# Altium schematic sheet Wireless.SchDoc: main_assy PCB
size A4
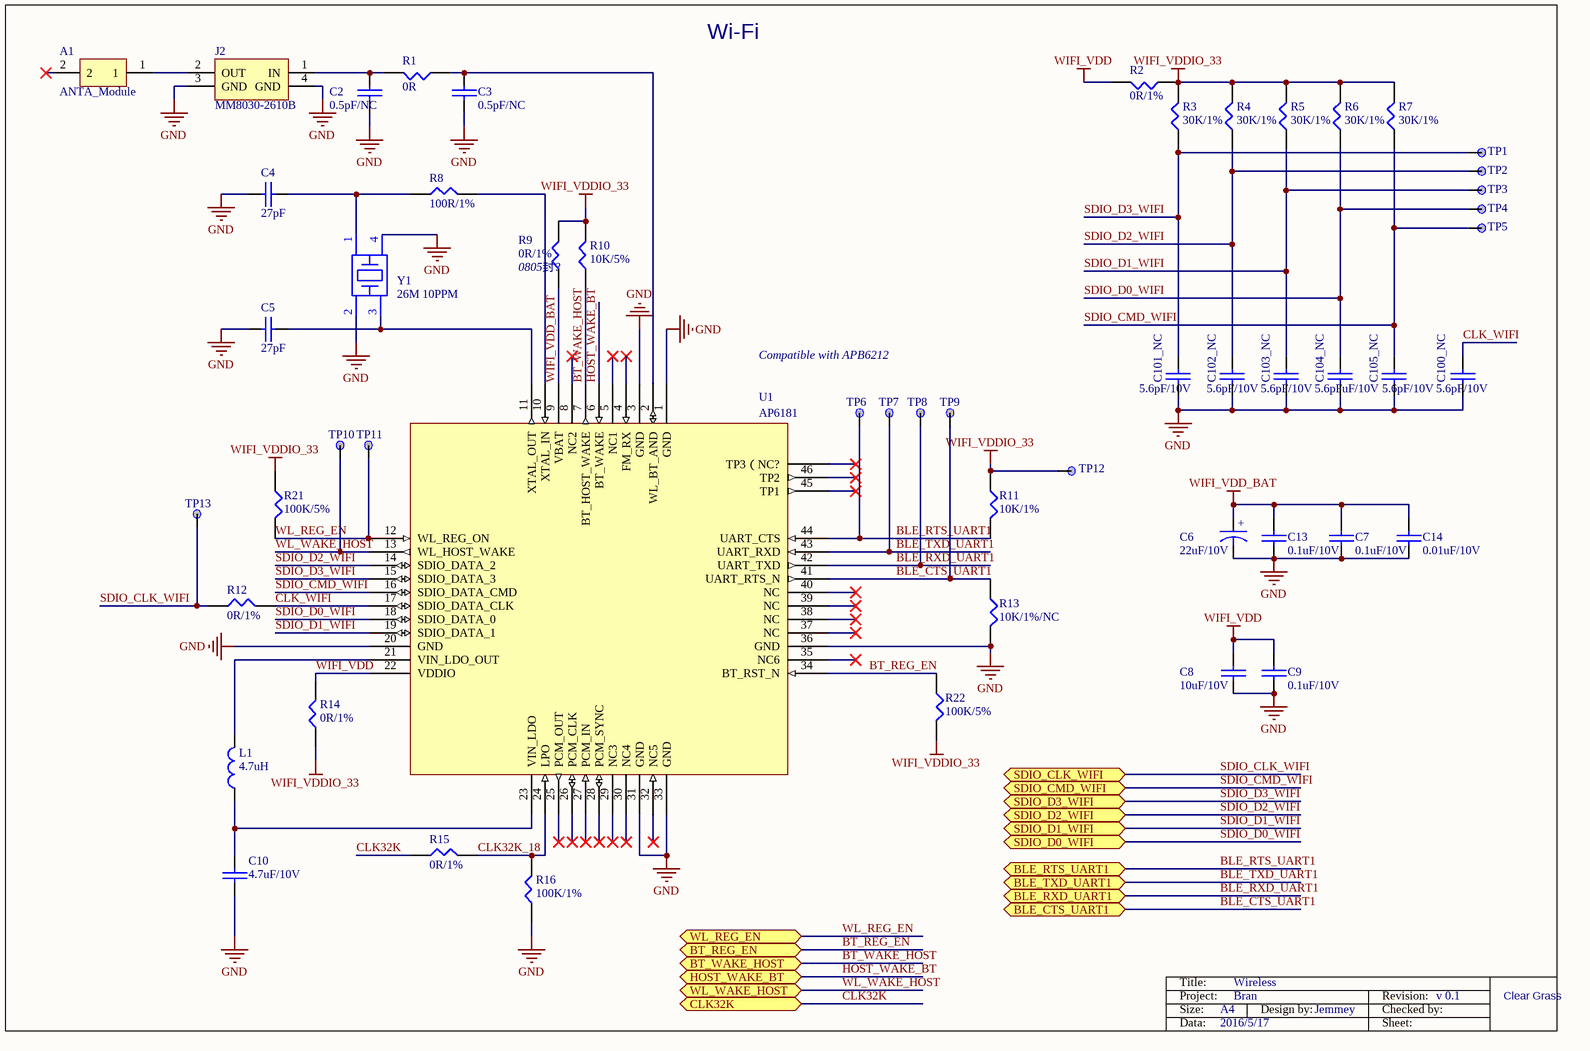
[diagram p0: Wireless.SchDoc]

## Parts
A1  ANTA_Module  [IPEX]
C2  0.5pF/NC  [0402C]
C3  0.5pF/NC  [0402C]
C4  27pF  [0402C]
C5  27pF  [0402C]
C6  22uF/10V  [6032]
C7  0.1uF/10V  [0402C]
C8  10uF/10V  [0402C]
C9  0.1uF/10V  [0402C]
C10  4.7uF/10V  [0402C]
C13  0.1uF/10V  [0402C]
C14  0.01uF/10V  [0402C]
C100_NC  5.6pF/10V  [0402C]
C101_NC  5.6pF/10V  [0402C]
C102_NC  5.6pF/10V  [0402C]
C103_NC  5.6pF/10V  [0402C]
C104_NC  5.6pFuF/10V  [0402C]
C105_NC  5.6pF/10V  [0402C]
J2  MM8030-2610B  [IPEX]
L1  4.7uH  [Inductance]
R1  0R  [0402R]
R2  0R/1%  [0402R]
R3  30K/1%  [0402R]
R4  30K/1%  [0402R]
R5  30K/1%  [0402R]
R6  30K/1%  [0402R]
R7  30K/1%  [0402R]
R8  100R/1%  [0402R]
R9  0R/1%  [0402R]
R10  10K/5%  [0402R]
R11  10K/1%  [0402R]
R12  0R/1%  [0402R]
R13  10K/1%/NC  [0402R]
R14  0R/1%  [0402R]
R15  0R/1%  [0402R]
R16  100K/1%  [0402R]
R21  100K/5%  [0402R]
R22  100K/5%  [0402R]
TP1  TP  [TP_C40]  (value not drawn)
TP2  TP  [TP_C40]  (value not drawn)
TP3  TP  [TP_C40]  (value not drawn)
TP4  TP  [TP_C40]  (value not drawn)
TP5  TP  [TP_C40]  (value not drawn)
TP6  TP  [TP_C40]  (value not drawn)
TP7  TP  [TP_C40]  (value not drawn)
TP8  TP  [TP_C40]  (value not drawn)
TP9  TP  [TP_C40]  (value not drawn)
TP10  TP  [TP_C40]  (value not drawn)
TP11  TP  [TP_C40]  (value not drawn)
TP12  TP  [TP_C40]  (value not drawn)
TP13  TP  [TP_C40]  (value not drawn)
U1  AP6181
Y1  26M 10PPM  [XTALSMD2-2520]

## Ports
BLE_CTS_UART1 (bidir), BLE_RTS_UART1 (bidir), BLE_RXD_UART1 (bidir), BLE_TXD_UART1 (bidir), BT_REG_EN (bidir), BT_WAKE_HOST (bidir), CLK32K (bidir), HOST_WAKE_BT (bidir), SDIO_CLK_WIFI (bidir), SDIO_CMD_WIFI (bidir), SDIO_D0_WIFI (bidir), SDIO_D1_WIFI (bidir), SDIO_D2_WIFI (bidir), SDIO_D3_WIFI (bidir), WL_REG_EN (bidir), WL_WAKE_HOST (bidir)

## Nets
GND: C2.2 C3.2 C4.1 C5.1 C6.2 C7.1 C8.1 C9.1 C10.2 C13.1 C14.1 C100_NC.1 C101_NC.1 C102_NC.1 C103_NC.1 C104_NC.1 C105_NC.1 J2.3(GND) J2.4(GND) R13.2 R16.1 U1.1(GND) U1.3(GND) U1.20(GND) U1.31(GND) U1.33(GND) U1.36(GND) Y1.2 Y1.4
WIFI_VDD: C8.2 C9.2 R2.2 R14.2 U1.22(VDDIO)
WIFI_VDD_BAT: C6.1 C7.2 C13.2 C14.2 R9.1 U1.9(VBAT)
WIFI_VDDIO_33: R2.1 R3.2 R4.2 R5.2 R6.2 R7.2 R9.2 R10.2 R11.1 R14.1 R21.1 R22.2 TP12.1
BLE_CTS_UART1: R13.1 TP9.1 U1.41(UART_RTS_N) ; port BLE_CTS_UART1
BLE_RTS_UART1: R11.2 TP6.1 U1.44(UART_CTS) ; port BLE_RTS_UART1
BLE_RXD_UART1: TP8.1 U1.42(UART_TXD) ; port BLE_RXD_UART1
BLE_TXD_UART1: TP7.1 U1.43(UART_RXD) ; port BLE_TXD_UART1
BT_REG_EN: R22.1 U1.34(BT_RST_N) ; port BT_REG_EN
BT_WAKE_HOST: R10.1 U1.7(BT_HOST_WAKE) ; port BT_WAKE_HOST
CLK32K: R15.1 ; port CLK32K
CLK32K_18: R15.2 R16.2 U1.24(LPO)
CLK_WIFI: C100_NC.2 R12.2 U1.17(SDIO_DATA_CLK)
HOST_WAKE_BT: U1.6(BT_WAKE) ; port HOST_WAKE_BT
SDIO_CLK_WIFI: R12.1 TP13.1 ; port SDIO_CLK_WIFI
SDIO_CMD_WIFI: C105_NC.2 R7.1 TP5.1 U1.16(SDIO_DATA_CMD) ; port SDIO_CMD_WIFI
SDIO_D0_WIFI: C104_NC.2 R6.1 TP4.1 U1.18(SDIO_DATA_0) ; port SDIO_D0_WIFI
SDIO_D1_WIFI: C103_NC.2 R5.1 TP3.1 U1.19(SDIO_DATA_1) ; port SDIO_D1_WIFI
SDIO_D2_WIFI: C102_NC.2 R4.1 TP2.1 U1.14(SDIO_DATA_2) ; port SDIO_D2_WIFI
SDIO_D3_WIFI: C101_NC.2 R3.1 TP1.1 U1.15(SDIO_DATA_3) ; port SDIO_D3_WIFI
WL_REG_EN: R21.2 TP11.1 U1.12(WL_REG_ON) ; port WL_REG_EN
WL_WAKE_HOST: TP10.1 U1.13(WL_HOST_WAKE) ; port WL_WAKE_HOST
NetA1_1: A1.1 J2.2(OUT)
NetC2_1: C2.1 J2.1(IN) R1.2
NetC3_1: C3.1 R1.1 U1.2(WL_BT_AND)
NetC4_2: C4.2 R8.1 Y1.1
NetC5_2: C5.2 U1.11(XTAL_OUT) Y1.3
NetC10_1: C10.1 L1.1 U1.23(VIN_LDO)
NetL1_2: L1.2 U1.21(VIN_LDO_OUT)
NetR8_2: R8.2 U1.10(XTAL_IN)

Not connected (* = marked no-connect by the designer): A1 2*; U1 4(FM_RX)* 5(NC1)* 8(NC2)* 25(PCM_OUT)* 26(PCM_CLK)* 27(PCM_IN)* 28(PCM_SYNC)* 29(NC3)* 30(NC4)* 32(NC5)* 35(NC6)* 37(NC)* 38(NC)* 39(NC)* 40(NC)* 45(TP1)* 46(TP2)* ?1(TP3（NC?)*

## Notes on the sheet
- Wi-Fi
- (near R9) 0805封?
- Compatible with APB6212
- Title:
- Wireless
- Project:
- Size:
- Data:
- A4
- 2016/5/17
- Bran
- Design by:
- Jemmey
- Revision:
- Sheet:
- Checked by:
- v 0.1
- Clear Grass
- (in symbol Capacitor) +

## Library data of the parts
C2 = CAP: 厂家：Murata，型号：GRM1555C1H1R0BA01D
C3 = CAP: None
C4 C5 C7-C10 C13 C14 C100_NC C101_NC C102_NC C103_NC C104_NC C105_NC = CAP: 厂家：Murata，型号：GRM155R71A104KA01D
C6 = Capacitor
J2 = SMA: 厂家：Murata，型号：MM8030-2610B
L1 = CHOKE
R1 = RES1: 厂家：Yageo，型号：RC0402FR-070RL
R2-R16 R21 R22 = RES1: 厂家：Yageo，型号：RC0402FR-0710KL
TP1-TP13 = TP: Ordered by: Subcon
U1 = AP6181: 厂家：正基，型号：AP6181
Y1 = CRYSTAL2: 厂家：EPSON，型号：Q24FA20H0004400